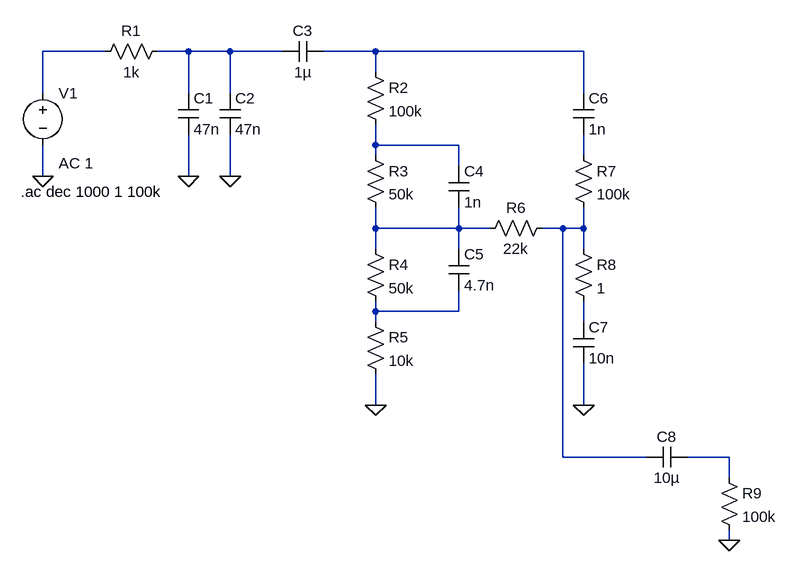
[diagram p0: schematic EQ.asc]
EQ.asc, the LTspice schematic file:
Version 4
SHEET 1 1184 804
WIRE 144 32 48 32
WIRE 272 32 224 32
WIRE 336 32 272 32
WIRE 416 32 336 32
WIRE 560 32 480 32
WIRE 880 32 560 32
WIRE 560 64 560 32
WIRE 48 96 48 32
WIRE 272 96 272 32
WIRE 336 96 336 32
WIRE 880 96 880 32
WIRE 560 176 560 144
WIRE 688 176 560 176
WIRE 560 192 560 176
WIRE 880 192 880 160
WIRE 688 208 688 176
WIRE 48 224 48 176
WIRE 272 224 272 160
WIRE 336 224 336 160
WIRE 560 304 560 272
WIRE 688 304 688 272
WIRE 688 304 560 304
WIRE 736 304 688 304
WIRE 848 304 816 304
WIRE 880 304 880 272
WIRE 880 304 848 304
WIRE 560 336 560 304
WIRE 688 336 688 304
WIRE 880 336 880 304
WIRE 560 432 560 416
WIRE 688 432 688 400
WIRE 688 432 560 432
WIRE 560 448 560 432
WIRE 880 448 880 416
WIRE 560 576 560 528
WIRE 880 576 880 512
WIRE 848 656 848 304
WIRE 976 656 848 656
WIRE 1104 656 1040 656
WIRE 1104 688 1104 656
WIRE 1104 784 1104 768
FLAG 48 224 0
FLAG 272 224 0
FLAG 336 224 0
FLAG 560 576 0
FLAG 880 576 0
FLAG 1104 784 0
SYMBOL voltage 48 80 R0
WINDOW 123 24 124 Left 2
WINDOW 39 0 0 Left 0
SYMATTR InstName V1
SYMATTR Value ""
SYMATTR Value2 AC 1
SYMBOL res 240 16 R90
WINDOW 0 0 56 VBottom 2
WINDOW 3 32 56 VTop 2
SYMATTR InstName R1
SYMATTR Value 1k
SYMBOL cap 256 96 R0
SYMATTR InstName C1
SYMATTR Value 47n
SYMBOL cap 320 96 R0
SYMATTR InstName C2
SYMATTR Value 47n
SYMBOL cap 480 16 R90
WINDOW 0 0 32 VBottom 2
WINDOW 3 32 32 VTop 2
SYMATTR InstName C3
SYMATTR Value 1µ
SYMBOL res 544 48 R0
SYMATTR InstName R2
SYMATTR Value 100k
SYMBOL res 544 176 R0
SYMATTR InstName R3
SYMATTR Value 50k
SYMBOL res 544 320 R0
SYMATTR InstName R4
SYMATTR Value 50k
SYMBOL res 544 432 R0
SYMATTR InstName R5
SYMATTR Value 10k
SYMBOL cap 672 208 R0
SYMATTR InstName C4
SYMATTR Value 1n
SYMBOL cap 672 336 R0
SYMATTR InstName C5
SYMATTR Value 4.7n
SYMBOL res 832 288 R90
WINDOW 0 0 56 VBottom 2
WINDOW 3 32 56 VTop 2
SYMATTR InstName R6
SYMATTR Value 22k
SYMBOL res 864 176 R0
SYMATTR InstName R7
SYMATTR Value 100k
SYMBOL res 864 320 R0
SYMATTR InstName R8
SYMATTR Value 1
SYMBOL cap 864 96 R0
SYMATTR InstName C6
SYMATTR Value 1n
SYMBOL cap 864 448 R0
SYMATTR InstName C7
SYMATTR Value 10n
SYMBOL cap 1040 640 R90
WINDOW 0 0 32 VBottom 2
WINDOW 3 32 32 VTop 2
SYMATTR InstName C8
SYMATTR Value 10µ
SYMBOL res 1088 672 R0
SYMATTR InstName R9
SYMATTR Value 100k
TEXT 14 248 Left 2 !.ac dec 1000 1 100k

The netlist it stands for:
* EQ.asc
V1 N001 0 AC 1
R1 N002 N001 1k
C1 N002 0 47n
C2 N002 0 47n
C3 N003 N002 1µ
R2 N003 N004 100k
R3 N004 N006 50k
R4 N006 N008 50k
R5 N008 0 10k
C4 N004 N006 1n
C5 N006 N008 4.7n
R6 N007 N006 22k
R7 N005 N007 100k
R8 N007 N009 1
C6 N003 N005 1n
C7 N009 0 10n
C8 N010 N007 10µ
R9 N010 0 100k
.ac dec 1000 1 100k
.backanno
.end